# Altium schematic sheet Sheet1.SchDoc
size C; SheetNumber: 1; SheetTotal: 3
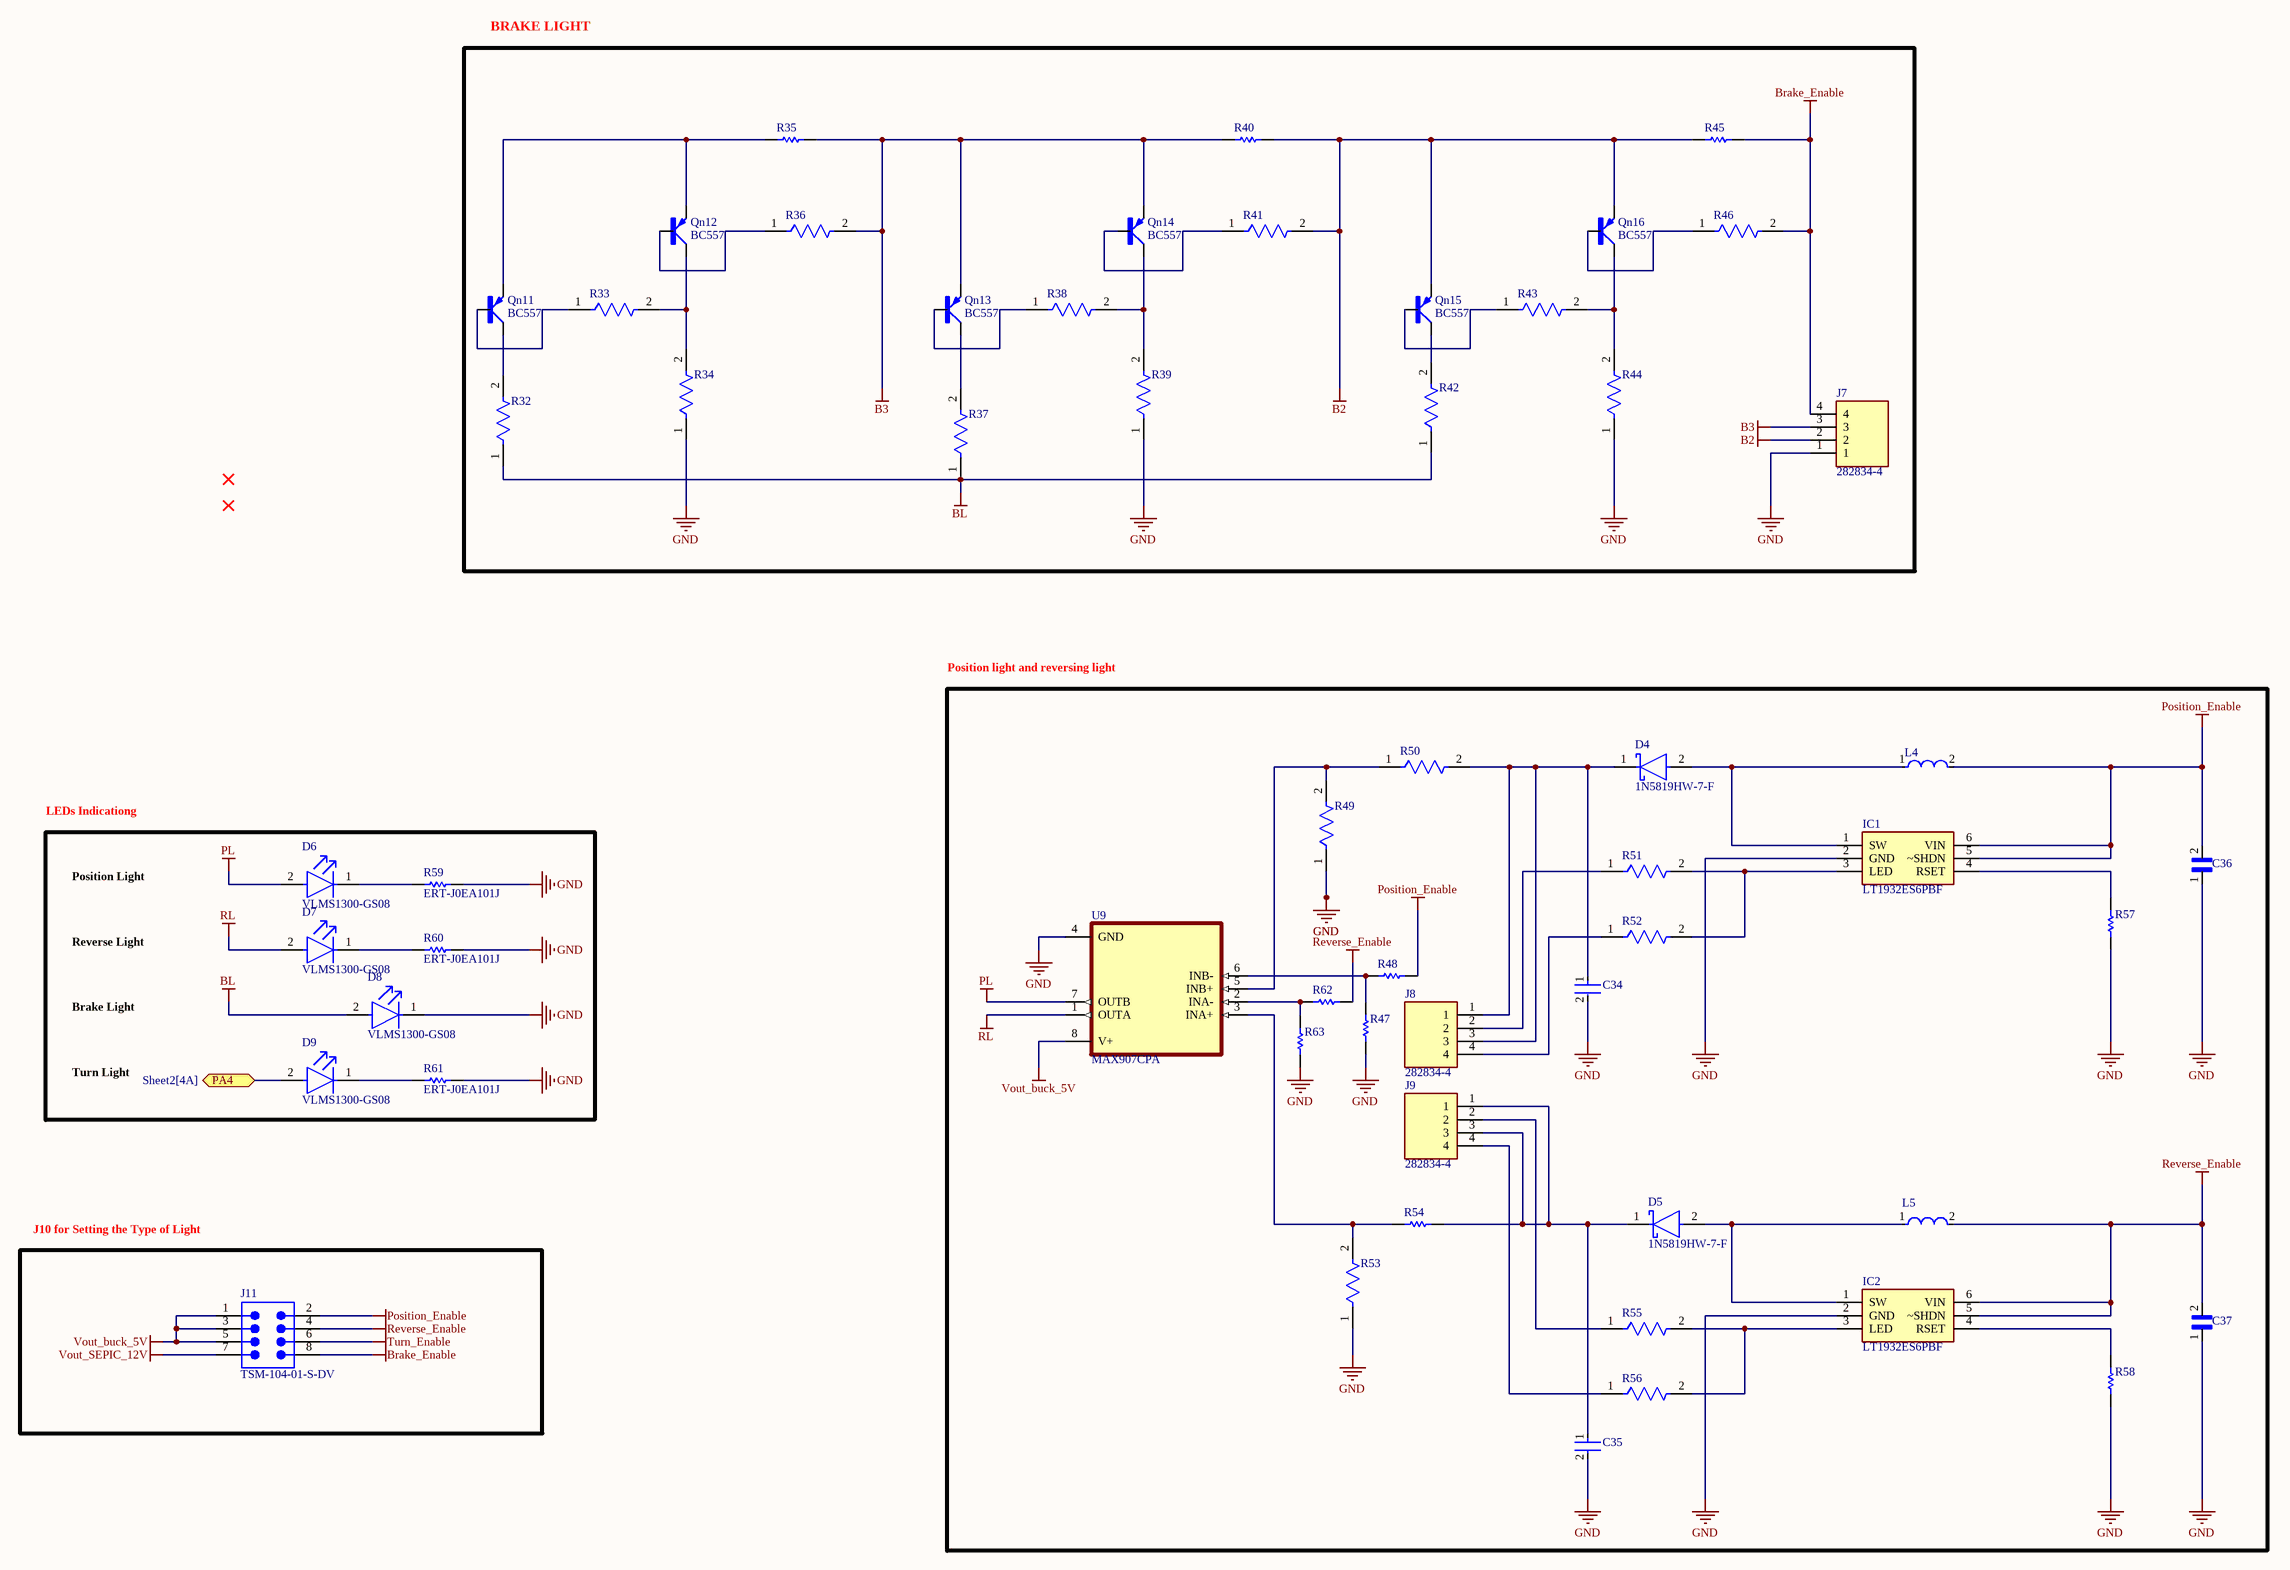
[diagram p0: Sheet1.SchDoc]

## Parts
C34  TMK325BJ475KN-T  [FP-1210-L_3_2_0_3-W_2_5_0-IPC_C]  (value not drawn)
C35  TMK325BJ475KN-T  [FP-1210-L_3_2_0_3-W_2_5_0-IPC_C]  (value not drawn)
C36  JMK212BJ475MD-T  [CAPC2012X95N]  (value not drawn)
C37  JMK212BJ475MD-T  [CAPC2012X95N]  (value not drawn)
D4  1N5819HW-7-F  [FP-SOD123-IPC_A]
D5  1N5819HW-7-F  [FP-SOD123-IPC_A]
D6  VLMS1300-GS08  [FP-6_541-5092_01-4-MFG]
D7  VLMS1300-GS08  [FP-6_541-5092_01-4-MFG]
D8  VLMS1300-GS08  [FP-6_541-5092_01-4-MFG]
D9  VLMS1300-GS08  [FP-6_541-5092_01-4-MFG]
IC1  LT1932ES6PBF  [SOT95P280X145-6N]
IC2  LT1932ES6PBF  [SOT95P280X145-6N]
J7  282834-4  [TE_282834-4]
J8  282834-4  [TE_282834-4]
J9  282834-4  [TE_282834-4]
J11  TSM-104-01-S-DV  [SMTC-TSM-104-01-X-DV]
L4  NRH3012T100MN  [FP-NR3012-MFG]  (value not drawn)
L5  NRH3012T100MN  [FP-NR3012-MFG]  (value not drawn)
Qn11  BC557  [SOT54A]
Qn12  BC557  [SOT54A]
Qn13  BC557  [SOT54A]
Qn14  BC557  [SOT54A]
Qn15  BC557  [SOT54A]
Qn16  BC557  [SOT54A]
R32  CRCW04021K00FKED  [FP-CRCW0402-e3-MFG]  (value not drawn)
R33  CRCW04021K00FKED  [FP-CRCW0402-e3-MFG]  (value not drawn)
R34  CRCW040210K0JNED  [FP-CRCW0402-e3-IPC_B]  (value not drawn)
R35  CRCW0402240RFKED  [RESC1005X40X25ML05T05]  (value not drawn)
R36  CRCW04021K00FKED  [FP-CRCW0402-e3-MFG]  (value not drawn)
R37  CRCW04021K00FKED  [FP-CRCW0402-e3-MFG]  (value not drawn)
R38  CRCW04021K00FKED  [FP-CRCW0402-e3-MFG]  (value not drawn)
R39  CRCW040210K0JNED  [FP-CRCW0402-e3-IPC_B]  (value not drawn)
R40  CRCW0402240RFKED  [RESC1005X40X25ML05T05]  (value not drawn)
R41  CRCW04021K00FKED  [FP-CRCW0402-e3-MFG]  (value not drawn)
R42  CRCW04021K00FKED  [FP-CRCW0402-e3-MFG]  (value not drawn)
R43  CRCW04021K00FKED  [FP-CRCW0402-e3-MFG]  (value not drawn)
R44  CRCW040210K0JNED  [FP-CRCW0402-e3-IPC_B]  (value not drawn)
R45  CRCW0402240RFKED  [RESC1005X40X25ML05T05]  (value not drawn)
R46  CRCW04021K00FKED  [FP-CRCW0402-e3-MFG]  (value not drawn)
R47  ERJ-3EKF1001V  [RESC1608X55X30LL15T15]  (value not drawn)
R48  CPF0402B665RE1  [RESC1005X35X20ML05T10]  (value not drawn)
R49  RC0603FR-071KL  [FP-RC0603-0_55-IPC_C]  (value not drawn)
R50  RC3216J432CS  [FP-RC3216-IPC_B]  (value not drawn)
R51  CRCW0402100RJNED  [FP-CRCW0402-e3-IPC_A]  (value not drawn)
R52  CRCW0402100RJNED  [FP-CRCW0402-e3-IPC_A]  (value not drawn)
R53  RC0603FR-071KL  [FP-RC0603-0_55-IPC_C]  (value not drawn)
R54  RC1206FR-072K2L  [RESC3116X65X40ML10T20]  (value not drawn)
R55  CRCW0402100RJNED  [FP-CRCW0402-e3-IPC_A]  (value not drawn)
R56  CRCW0402100RJNED  [FP-CRCW0402-e3-IPC_A]  (value not drawn)
R57  ERJ-2RKF5620X  [RESC1005X40X25LL05T05]  (value not drawn)
R58  ERJ-2RKF5620X  [RESC1005X40X25LL05T05]  (value not drawn)
R59  ERT-J0EA101J  [RESC1005X40X25NL05T05]
R60  ERT-J0EA101J  [RESC1005X40X25NL05T05]
R61  ERT-J0EA101J  [RESC1005X40X25NL05T05]
R62  CPF0402B665RE1  [RESC1005X35X20ML05T10]  (value not drawn)
R63  ERJ-3EKF1001V  [RESC1608X55X30LL15T15]  (value not drawn)
U9  MAX907CPA  [DIP794W47P254L991H457Q8]

## Blocks framed on the sheet
BRAKE LIGHT: J7 Qn11-Qn16 R32-R46
Position light and reversing light: C34-C37 D4 D5 IC1 IC2 J8 J9 L4 L5 R47-R58 R62 R63 U9
J10 for Setting the Type of Light: J11

## Ports
PA4 (bidir, see Sheet2[4A])

## Nets
B2: J7.2 Qn15.E Qn16.E R40.2 R41.2 R45.1
B3: J7.3 Qn13.E Qn14.E R35.2 R36.2 R40.1
BL: D8.2(A) R32.1 R37.1 R42.1
Brake_Enable: J7.4 J11.8 R45.2 R46.2
GND: C34.2 C35.2 C36.1 C37.1 D8.1(C) IC1.2(GND) IC2.2(GND) J7.1 R34.1 R39.1 R44.1 R47.1 R49.1 R53.1 R57.1 R58.1 R59.2 R60.2 R61.2 R63.1 U9.4(GND)
PL: D6.2(A) U9.7(OUTB)
Position_Enable: C36.2 IC1.5(~SHDN) IC1.6(VIN) J11.2 L4.2 R48.2
Reverse_Enable: C37.2 IC2.5(~SHDN) IC2.6(VIN) J11.4 L5.2 R62.2
RL: D7.2(A) U9.1(OUTA)
Turn_Enable: J11.6
Vout_buck_5V: J11.1 J11.3 J11.5 U9.8(V+)
Vout_SEPIC_12V: J11.7
PA4: D9.2(A) ; port PA4
NetC34_1: C34.1 D4.1(C) J8.1 J8.3 R50.2
NetC35_1: C35.1 D5.1(C) J9.1 J9.3 R54.2
NetD4_2: D4.2(A) IC1.1(SW) L4.1
NetD5_2: D5.2(A) IC2.1(SW) L5.1
NetD6_1: D6.1(C) R59.1
NetD7_1: D7.1(C) R60.1
NetD9_1: D9.1(C) R61.1
NetIC1_3: IC1.3(LED) R51.2 R52.2
NetIC1_4: IC1.4(RSET) R57.2
NetIC2_3: IC2.3(LED) R55.2 R56.2
NetIC2_4: IC2.4(RSET) R58.2
NetJ8_2: J8.2 R51.1
NetJ8_4: J8.4 R52.1
NetJ9_2: J9.2 R55.1
NetJ9_4: J9.4 R56.1
NetQn11_B: Qn11.B R33.1
NetQn11_C: Qn11.C R32.2
NetQn11_E: Qn11.E Qn12.E R35.1
NetQn12_B: Qn12.B R36.1
NetQn12_C: Qn12.C R33.2 R34.2
NetQn13_B: Qn13.B R38.1
NetQn13_C: Qn13.C R37.2
NetQn14_B: Qn14.B R41.1
NetQn14_C: Qn14.C R38.2 R39.2
NetQn15_B: Qn15.B R43.1
NetQn15_C: Qn15.C R42.2
NetQn16_B: Qn16.B R46.1
NetQn16_C: Qn16.C R43.2 R44.2
NetR47_2: R47.2 R48.1 U9.6(INB-)
NetR49_2: R49.2 R50.1 U9.5(INB+)
NetR53_2: R53.2 R54.1 U9.3(INA+)
NetR62_1: R62.1 R63.2 U9.2(INA-)

## Notes on the sheet
- LEDs Indicationg
- Position Light
- Reverse Light
- Brake Light
- Turn Light

## Library data of the parts
C34 C35 = CMP-14477-002701-2: None; Voltage Rating (DC): 25V; Dielectric: X5R; Tolerance: 10%; Capacitance: 4.7uF; Lead Free: Lead Free; Thickness: 0.083inch; Case Code (Imperial): 1210; Min Operating Temperature: -55°C; Series: M; RoHS Compliant: Yes; Radiation Hardening: No; Width: 0.098inch; Packaging: Tape and Reel; Construction: Flat; Height: 1.9mm; Depth: 2.5mm; Halogen Free: Halogen Free; Case Code (Metric): 3225; Mount: Surface Mount; Termination: SMD/SMT; Max Operating Temperature: 85°C; Voltage Rating: 25V; Case/Package: 1210; Length: 0.126inch
C36 C37 = JMK212BJ475MD-T: Cap Ceramic 4.7uF 6.3V X5R 20% Pad SMD 0805 85C T/R; Package: None; Price: None; Value: *; MP: JMK212BJ475MD-T; Availability: Unavailable
D4 D5 = CMP-0303-00003-3: DIODE SCHOTTKY 40V 1A SOD123; Forward Voltage: 450mV; Capacitance: 110pF; Max Forward Surge Current (Ifsm): 25A; Peak Reverse Current: 50uA; Polarity: Standard; Element Configuration: Single; Max Power Dissipation: 450mW; Min Operating Temperature: -65°C; Package Quantity: 3000; Contact Plating: Tin; Weight: 0.000353oz; Max Repetitive Reverse Voltage (Vrrm): 40V; Max Reverse Voltage (DC): 40V; Height: 1.25mm; Average Rectified Current: 1A; Width: 1.7mm; Case/Package: SOD-123-2; Lead Free: Lead Free; Max Operating Temperature: 125°C; Current Rating: 1A; Termination: SMD/SMT; Forward Current: 1A; Radiation Hardening: No; Number of Pins: 2; Length: 2.85mm; Voltage Rating (DC): 40V; REACH SVHC: No SVHC; Peak Non-Repetitive Surge Current: 25A; Packaging: Tape and Reel; Output Current: 1A
D6-D9 = CMP-02520-000012-1: LED RED 0603 SMD; Manufacturer: Vishay; Forward Voltage: 2V; Reverse Voltage: 5V; Power Dissipation: 75mW; Forward Current: 20mA; Luminous Intensity: 54mcd; Led Orientation: Top View; Peak Emmision Wavelength: 639nm; Viewing Angle: 130°; Wavelength: 631nm; Digikey Description: LED RED 0603 SMD; Height: 1mm; Colour: Red; Ambient Temperature Range High: +85°C; Ambient Temperature Range Low: -35°C; Package: 6.541-5092.01-4; Automotive: No; Temperature Range High: +85°C; Device Class L3: unset; Lead Free: Yes; Temperature Range Low: -35°C; Temperature: -35°C to +85°C; Manufacturer Part Number: VLMS1300-GS08; Device Class L2: LEDs; ComponentLink2Description: Datasheet; Octopart: https://octopart.com/vlms1300-gs08-vishay-21709201; Device Class L1: Optoelectronics; RoHS: TRUE; ComponentLink2URL: http://www.vishay.com/docs/82437/vlmo1300.pdf; Mouser Description: Standard LEDs - SMD Super Red Clear Non-Diff; Category: Diode
IC1 IC2 = LT1932ES6PBF: Integrated Circuit; Manufacturer_Name: Analog Devices; Manufacturer_Part_Number: LT1932ES6PBF
J7-J9 = 282834-4: 4 Position Wire to Board Terminal Block Horizontal with Board 0.100 (2.54mm) Through Hole; MF: TE Connectivity; Check_prices: https://www.snapeda.com/parts/282834-4/TE+Connectivity+AMP+Connectors/view-part/?ref=eda; Price: None; MP: 282834-4; Package: None; Value: *; Purchase-URL: https://pricing.snapeda.com/search/part/282834-4/?ref=eda; Availability: In Stock; EU_RoHS_Compliance: Compliant with Exemptions; SnapEDA_Link: https://www.snapeda.com/parts/282834-4/TE+Connectivity+AMP+Connectors/view-part/?ref=snap
J11 = CMP-1024-00218-1: 0.025" SQ Post Header, Surface Mount, Vertical, -55 to 125 degC, 2.54 mm Pitch, 8-Pin, Male, RoHS; Manufacturer: Samtec; Pitch: 2.54 mm; ComponentLink3URL: http://www.samtec.com/documents/webfiles/cpdf/TSM-1XX-XX-XXX-XX-X-XXX-X-MKT.pdf; ComponentLink1URL: http://www.samtec.com; PackageDescription: Double Row Gullwing ASM; ComponentLink3Description: Package Specification; PackageVersion: DJ, 4/1991; ComponentLink1Description: Manufacturer URL; Orientation: Vertical; Temperature Range: -55 to 125 degC; PartNumber: TSM-104-01-S-DV; ComponentLink2Description: Datasheet; RoHS: True; Mounting Technology: Surface Mount; ComponentLink2URL: http://www.samtec.com/documents/webfiles/pdf/TSM.PDF; PackageReference: TSM-104-01-X-DV; DatasheetVersion: F-214
L4 L5 = CMP-14484-000575-1: SMD Power Inductors 10uH ±20% 0.72A 0.27Ω; Core Material: Ferrite; Max DC Current: 730mA; Self Resonant Frequency: 32MHz; Test Frequency: 100kHz; DC Resistance (DCR): 324mR; Current Rating: 720mA; Shielding: Shielded; Radiation Hardening: No; Min Operating Temperature: -25°C; Termination: SMD/SMT; Packaging: Tape and Reel; Height: 1.2mm; Mount: Surface Mount; Saturation Current: 730mA; Max Operating Temperature: 120°C; Inductance Tolerance: 20%; Package Quantity: 2000; Lead Free: Lead Free; RoHS Compliant: Yes; Depth: 3.1mm; Width: 3mm; Inductance: 10uH; Length: 3mm; Case/Package: 3012; Resistor Type: Wirewound; Halogen Free: Halogen Free; RMS Current (Irms): 720mA; Height - Seated (Max): 0.047inch; Series: NRH; Tolerance: 20%
Qn11-Qn16 = BC557: Bipolar (BJT) Transistor PNP 45 V 100 mA 320MHz 625 mW Through Hole TO-92 (TO-226); MF: ON; Availability: In Stock; Package: E-PKG AXIAL-LEADED-2 ON Semiconductor; MP: BC557; Value: *; Check_prices: https://www.snapeda.com/parts/BC557/Onsemi/view-part/?ref=eda; SnapEDA_Link: https://www.snapeda.com/parts/BC557/Onsemi/view-part/?ref=snap; Price: None
R32 R33 R36-R38 R41-R43 R46 = CMP-2002-08276-2: RES Thick Film, 1kΩ, 1%, 0.063W, 100ppm/°C, 0402; Resistance: 1kR; Power Rating: 63mW; Voltage Rating (DC): 50V; Package Quantity: 10; Termination: SMD/SMT; Width: 0.5mm; Military Standard: Not; Length: 1mm; Contact Plating: Tin; Mount: Surface Mount; Packaging: Tape and Reel; Case Code (Imperial): 0402; Tolerance: 1%; Weight: 2.3E-05oz; Number of Pins: 2; Case/Package: 0402; Case Code (Metric): 1005; Lead Free: Lead Free; Number of Terminations: 2; Max Power Dissipation: 63mW; Depth: 0.5mm; Temperature Coefficient: 100ppm/°C; Max Operating Temperature: 155°C; Height: 0.35mm; Features: Automotive AEC-Q200; Composition: Thick Film; Radiation Hardening: No; Voltage Rating: 50V; Min Operating Temperature: -55°C
R34 R39 R44 = CMP-2002-08136-3: RES Thick Film, 10kΩ, 5%, 0.063W, 200ppm/°C, 0402; Voltage Rating: 50V; Power Rating: 63mW; Resistance: 10kR; Military Standard: Not; Packaging: Tape and Reel; Case Code (Imperial): 0402; Min Operating Temperature: -55°C; Case Code (Metric): 1005; Case/Package: 0402; Temperature Coefficient: 200ppm/°C; Termination: SMD/SMT; Composition: Thick Film; Depth: 0.5mm; Number of Terminations: 2; Contact Plating: Tin; Height: 0.016inch; Width: 0.5mm; Max Operating Temperature: 155°C; Features: Automotive AEC-Q200; Length: 1mm; Radiation Hardening: No; Max Power Dissipation: 63mW; Mount: Surface Mount; Tolerance: 5%; Package Quantity: 1; Weight: 2.3E-05oz
R35 R40 R45 = CMP-2002-08397-1: Manufacturer: Vishay Dale; Part Number: CRCW0402240RFKED
R47 R63 = CMP-2000-00180-1: Manufacturer: Panasonic; Part Number: ERJ-3EKF1001V
R48 R62 = CMP-2002-03359-1: Manufacturer: TE Connectivity / AMP; Part Number: CPF0402B665RE1
R49 R53 = CMP-1659-00009-5: RES 1K OHM 1% 1/10W 0603; Resistance: 1kR; Voltage Rating: 50V; Power Rating: 100mW; Temperature Coefficient: 100ppm/°C; Military Standard: Not; REACH SVHC: No SVHC; Size Code: 0603; Features: Moisture Resistant; Number of Terminations: 2; Technology: THICK FILM; Series: RC; Case Code (Metric): 1608; Resistance Tolerance: 1%; Resistor Type: Thick Film; Termination: SMD/SMT; Contact Plating: Tin; Radiation Hardening: No; Min Operating Temperature: -55°C; Max Operating Temperature: 155°C; Packaging: Tape and Reel; Max Power Dissipation: 100mW; RoHS Compliant: Yes; Height: 0.45mm; Lead Free: Lead Free; Case/Package: 0603; Length: 1.6mm; Tolerance: 1%; Case Code (Imperial): 0603; Construction: Rectangular; Depth: 0.8mm
R50 = CMP-13261-001781-1: Res Thick Film 1206 4.3kΩ 5% 0.25W ±100ppm/°C Molded SMD T/R; Voltage Rating (DC): 200V; Resistance: 4.3kR; Max Power Dissipation: 250mW; Lead Free: Lead Free; Features: Moisture Resistant; Max Operating Temperature: 155°C; Min Operating Temperature: -55°C; Case Code (Imperial): 1206; Case/Package: 1206; Tolerance: 5%; Case Code (Metric): 3216; Length: 0.126inch; Packaging: Tape and Reel; Composition: Thick Film; Temperature Coefficient: 100ppm/°C; Contact Plating: Tin; Width: 0.063inch; Height: 0.026inch; Number of Terminations: 2; Radiation Hardening: No
R51 R52 R55 R56 = CMP-2002-08129-2: RES Thick Film, 100Ω, 5%, 0.063W, 200ppm/°C, 0402; Resistance: 100R; Working Voltage: 50V; Max Power Dissipation: 63mW; Termination: SMD/SMT; Features: Automotive AEC-Q200; Radiation Hardening: No; Contact Plating: Tin; Military Standard: Not; Case Code (Metric): 1005; Max Operating Temperature: 155°C; Width: 0.02inch; Number of Terminations: 2; Case/Package: 0402; Height: 0.016inch; Voltage Rating: 50V; Tolerance: 5%; Mount: Surface Mount; Composition: Thick Film; Length: 1mm; Power Rating: 63mW; Case Code (Imperial): 0402; Temperature Coefficient: 200ppm/°C; Min Operating Temperature: -55°C; Weight: 2.3E-05oz; Depth: 0.5mm; Package Quantity: 10000; Packaging: Tape and Reel
R54 = CMP-1014-00546-2: Chip Resistor, 2.2 KOhm, +/- 1%, 250 mW, -55 to 155 degC, 1206 (3216 Metric), RoHS, Tape and Reel; Manufacturer: Yageo; Power Rating: 250mW; Voltage Rating: 200V; Temperature Coefficient: 100ppm/degreesC; RoHSCompliant: true; Packaging: TapeandReel; Termination: SMD/SMT; Case/Package: 1206; Case Code (Imperial): 1206; Manufacturer URL: http://www.yageo.com/; Max Power Dissipation: 250mW; Resistance: 2.2KOhm; Tolerance: 1%; Package Reference: 1206.0; Number of Terminations: 2; Depth: 1.6mm; Case Code (Metric): 3216; Lead Free: LeadFree; REACH SVHC: Unknown; Package Quantity: 1; Datasheet Version: Rev. 5, 10/2016; Length: 3.1mm; Weight: 0.000571oz; Composition: ThickFilm; Width: 0.063inch; Max Operating Temperature: 155degC; Package Description: 2-Pin Surface Mount Device, Body 3.1 x 1.6 mm; Min Operating Temperature: -55degC; Height: 0.55mm; Datasheet URL: http://www.yageo.com/NewPortal/yageodocoutput?fileName=/pdf/R-Chip/PYu-RC_Group_51_RoHS_L_5.pdf; Military Standard: Not
R57 R58 = CMP-2002-00994-1: Manufacturer: Panasonic; Part Number: ERJ-2RKF5620X
R59-R61 = CMP-2002-01176-1: Manufacturer: Panasonic; Part Number: ERT-J0EA101J
U9 = MAX907CPA: Comparator General Purpose TTL 8-PDIP; MF: Maxim Integrated; Package: DIP-8 Maxim Integrated; Check_prices: https://www.snapeda.com/parts/MAX907CPA/Maxim+Integrated/view-part/?ref=eda; Value: *; Price: None; Purchase-URL: https://pricing.snapeda.com/search/part/MAX907CPA/?ref=eda; MP: MAX907CPA; SnapEDA_Link: https://www.snapeda.com/parts/MAX907CPA/Maxim+Integrated/view-part/?ref=snap; Availability: In Stock